# Altium schematic sheet Nucleo.SchDoc: Nucleo
size A4; Author: Landi András; Organization: BME AUT; Address1: Magyar tudósok krt. 2.; Address2: Q épület; Address3: Budapest; Address4: H-1117; DocumentNumber: 1; Revision: 21; SheetNumber: 1; SheetTotal: 3
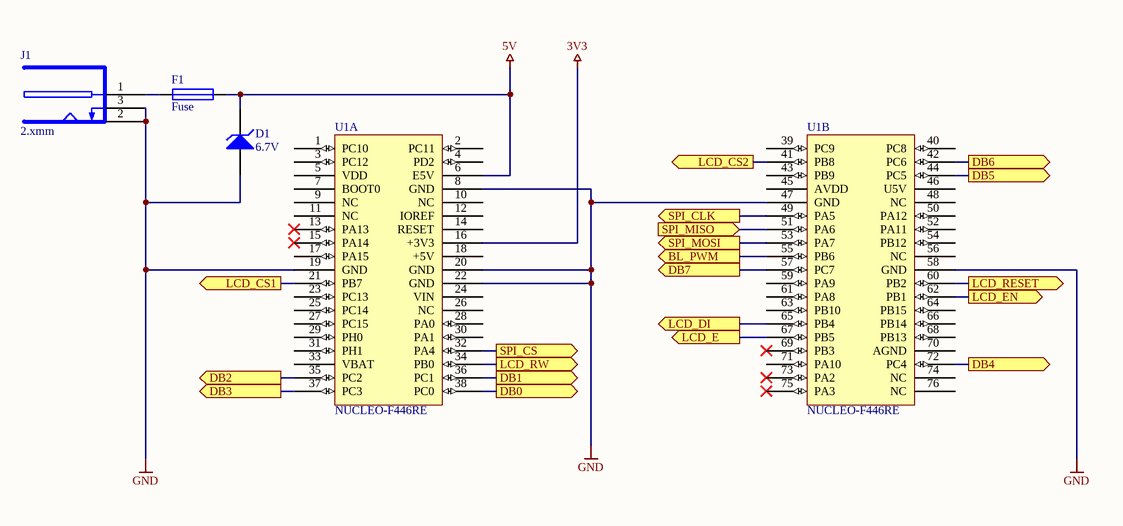
[diagram p0: Nucleo.SchDoc]

## Parts
D1  6.7V  [FP_SMA]
F1  Fuse  [FP_MULTIFUSE]
J1  2.xmm  [FP_DC_TAP_ANYA]
U1  NUCLEO-F446RE  [FP_NUCLEO-64_2x20]  (parts A,B of 2)

## Ports
BL_PWM (out), DB0 (out), DB1 (out), DB2 (out), DB3 (out), DB4 (out), DB5 (out), DB6 (out), DB7 (out), LCD_CS1 (out), LCD_CS2 (out), LCD_DI (out), LCD_E (out), LCD_EN (out), LCD_RESET (out), LCD_RW (out), SPI_CLK (out), SPI_CS (out), SPI_MISO (in), SPI_MOSI (out)

## Nets
3V3: U1.16(+3V3)
5V: D1.2(K) F1.2 U1.6(E5V)
GND: D1.1(A) J1.2(SLEEVE) J1.3(BREAK) U1.8(GND) U1.19(GND) U1.20(GND) U1.22(GND) U1.47(GND) U1.58(GND)
BL_PWM: U1.55(PB6) ; port BL_PWM
DB0: U1.38(PC0) ; port DB0
DB1: U1.36(PC1) ; port DB1
DB2: U1.35(PC2) ; port DB2
DB3: U1.37(PC3) ; port DB3
DB4: U1.72(PC4) ; port DB4
DB5: U1.44(PC5) ; port DB5
DB6: U1.42(PC6) ; port DB6
DB7: U1.57(PC7) ; port DB7
LCD_CS1: U1.21(PB7) ; port LCD_CS1
LCD_CS2: U1.41(PB8) ; port LCD_CS2
LCD_DI: U1.65(PB4) ; port LCD_DI
LCD_E: U1.67(PB5) ; port LCD_E
LCD_EN: U1.62(PB1) ; port LCD_EN
LCD_RESET: U1.60(PB2) ; port LCD_RESET
LCD_RW: U1.34(PB0) ; port LCD_RW
SPI_CLK: U1.49(PA5) ; port SPI_CLK
SPI_CS: U1.32(PA4) ; port SPI_CS
SPI_MISO: U1.51(PA6) ; port SPI_MISO
SPI_MOSI: U1.53(PA7) ; port SPI_MOSI
NetF1_1: F1.1 J1.1(PIN)

Not connected (* = marked no-connect by the designer): U1 1(PC10) 2(PC11) 3(PC12) 4(PD2) 5(VDD) 7(BOOT0) 9(NC) 10(NC) 11(NC) 12(IOREF) 13(PA13)* 14(RESET) 15(PA14)* 17(PA15) 18(+5V) 23(PC13) 24(VIN) 25(PC14) 26(NC) 27(PC15) 28(PA0) 29(PH0) 30(PA1) 31(PH1) 33(VBAT) 39(PC9) 40(PC8) 43(PB9) 45(AVDD) 46(U5V) 48(NC) 50(PA12) 52(PA11) 54(PB12) 56(NC) 59(PA9) 61(PA8) 63(PB10) 64(PB15) 66(PB14) 68(PB13) 69(PB3)* 70(AGND) 71(PA10) 73(PA2)* 74(NC) 75(PA3)* 76(NC)

## Notes on the sheet
- Title
- Size:
- Date:
- A4
- Number:
- Time:
- Revision:
- Sheet
- of
- File:

## Library data of the parts
D1 = ZENER: Zener Diode; Reference: 9550941; Name: VISHAY SMAJ5.0A-E3/61; Supplier: Farnell; U_Z: 6.7V
F1 = Fuse: Name: 1.25A 15V 1812L125/16DR POLYFUSE SMD 1812 (LFS) ˝LF125-16˝; Reference: 44-04-71; Supplier: Lomex
J1 = DC_TAP_ANYA: 2.xmm DC HEBA25 TÁPFESZÜLTSÉG ALJZAT ZÁRT, NYÁKBA 90°; Name: TÁP DC ANYA 5.5/2.1/9.5mm DCS-5521-5; Supplier: Lomex; Reference: 43-07-67
U1 = NUCLEO-F446RE: Reference: NUCLEO; Name: Nucleo F446RE; Supplier: Tanszék